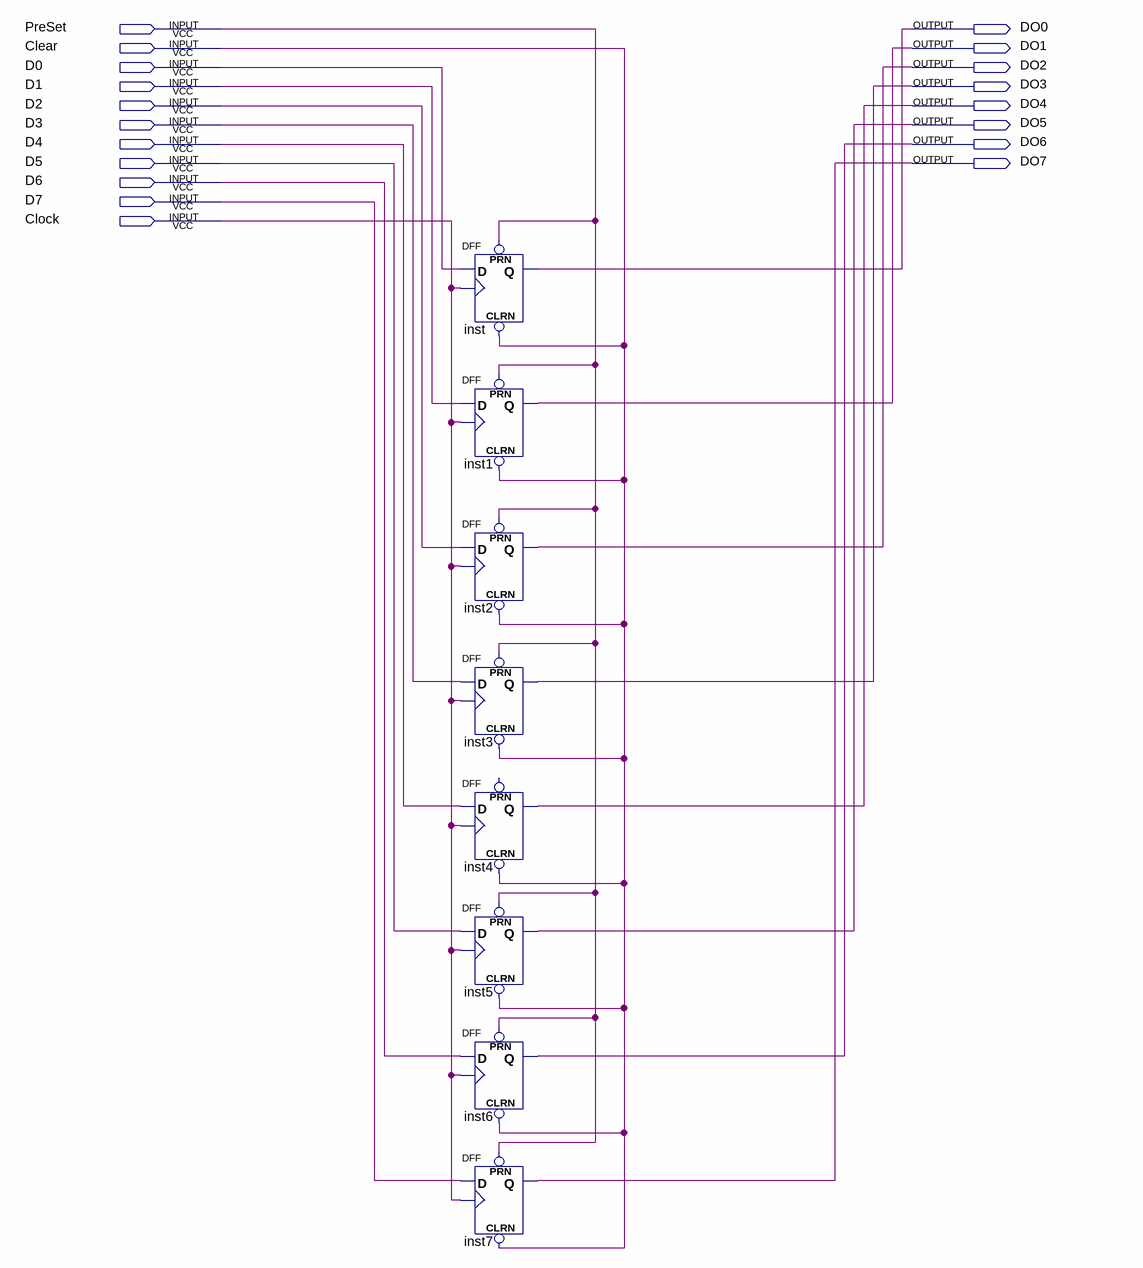
[diagram p0: schematic sheet]
// Quartus schematic PIPO8.bdf as structural Verilog: 8 symbols, 19 pins
module PIPO8 (
  input  PreSet,
  input  Clear,
  input  D0,
  input  D1,
  input  D2,
  input  D3,
  input  D4,
  input  D5,
  input  D6,
  input  D7,
  input  Clock,
  output DO0,
  output DO1,
  output DO2,
  output DO3,
  output DO4,
  output DO5,
  output DO6,
  output DO7
);

  DFF inst (.CLRN(Clear), .CLK(Clock), .D(D0), .PRN(PreSet), .Q(DO0));
  DFF inst1 (.CLRN(Clear), .CLK(Clock), .D(D1), .PRN(PreSet), .Q(DO1));
  DFF inst2 (.CLRN(Clear), .CLK(Clock), .D(D2), .PRN(PreSet), .Q(DO2));
  DFF inst3 (.CLRN(Clear), .CLK(Clock), .D(D3), .PRN(PreSet), .Q(DO3));
  DFF inst4 (.CLRN(Clear), .CLK(Clock), .D(D4), .Q(DO4));  // open: PRN
  DFF inst5 (.CLRN(Clear), .CLK(Clock), .D(D5), .PRN(PreSet), .Q(DO5));
  DFF inst6 (.CLRN(Clear), .CLK(Clock), .D(D6), .PRN(PreSet), .Q(DO6));
  DFF inst7 (.CLRN(Clear), .CLK(Clock), .D(D7), .PRN(PreSet), .Q(DO7));
endmodule
